# Altium schematic sheet HEADRE.SchDoc
size A3; SheetNumber: 1; SheetTotal: 5
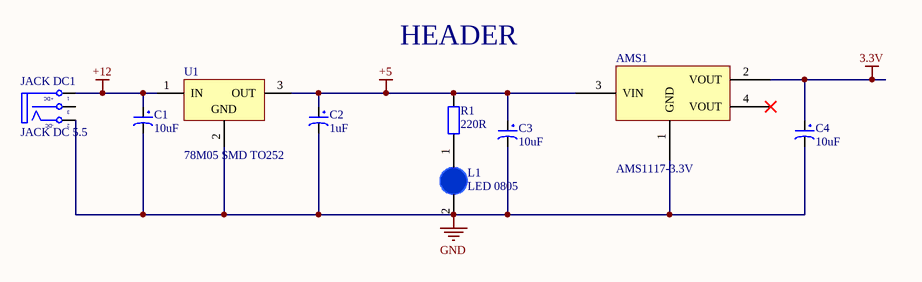
[diagram p0: HEADRE.SchDoc]

## Parts
AMS1  AMS1117-3.3V  [SOT223]
C1  10uF  [tu tantalum smd3216]
C2  1uF  [tu tantalum smd3216]
C3  10uF  [tu tantalum smd3216]
C4  10uF  [tu tantalum smd3216]
JACK_DC1  JACK DC 5.5  [JACK DC 5.5]
L1  LED 0805  [LED-0805-Blue]
R1  220R  [tro smd 0603]
U1  78M05 SMD TO252  [TO252]

## Nets
3.3V: AMS1.2(VOUT) C4.1
+5: AMS1.3(VIN) C2.1 C3.1 R1.2 U1.3(OUT)
+12: C1.1 JACK_DC1.1(T) U1.1(IN)
GND: AMS1.1(GND) C1.2 C2.2 C3.2 C4.2 JACK_DC1.2(TN) L1.2(K) U1.2(GND)
NetL1_1: L1.1(A) R1.1

Not connected (* = marked no-connect by the designer): AMS1 4(VOUT)*; JACK_DC1 3(S)

## Notes on the sheet
- HEADER
- (in symbol JACK DC 5.5) +DC; -DC

## Library data of the parts
AMS1 = AMS1117 SMD: Dán; Value: AMS1117-3.3V SOT223; Don_Vi: Con; Ma_Hang: MH000596; Ghi_Chu: *; Kieu_Chan: *; Chung_Loai: Dán
C1 C3 C4 = Tu tantalum 10uF 16V SMD3216: Dán; Don_Vi: Con; So_Chan: 2; Ten_Linh_Kien: Tụ tantalum 106C-10uF 16V SMD3216; Ma_Hang: MH001954; Chung_Loai: Dán; Kieu_Chan: *
C2 = Tu tantalum 1uF 25V SMD3216: Dán; Don_Vi: Con; So_Chan: 2; Ten_Linh_Kien: Tụ tantalum 105E-1uF 25V SMD3216; Ma_Hang: MH007472; Chung_Loai: Dán; Kieu_Chan: *
JACK_DC1 = JACK DC 5.5: Value: Jac DC
L1 = LED 0805 Xanh Duong: Dán; Don_Vi: Con; Ma_Hang: MH002327; Ten_Linh_Kien: LED 0805 Màu Xanh Dương (Blue); Ghi_Chu: *; Kieu_Chan: *; Chung_Loai: Dán
R1 = Tro 0603 5% 220R: Dán; Don_Vi: Con; So_Chan: 2; Ten_Linh_Kien: Trở 0603 5% 220R; Ma_Hang: MH006322; Chung_Loai: Dán; Kieu_Chan: *
U1 = 78M05 SMD TO252: Dán; Don_Vi: Con; Ten_Linh_Kien: 78M05 TO252; Ma_Hang: MH001917; Ghi_Chu: *; Kieu_Chan: *; Chung_Loai: Dán